# Altium schematic sheet Sheet_1_2025-06-25.schdoc
size 51 x 40 mm
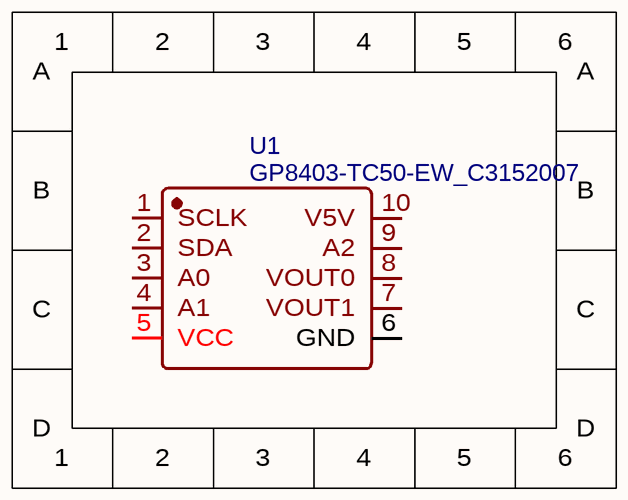
[diagram p0: Sheet_1_2025-06-25.schdoc]

## Parts
U1  GP8403-TC50-EW_C3152007  [ESSOP-10_L4.9-W3.9-P1.00-LS6.0-BL-EP]

## Nets

Not connected (* = marked no-connect by the designer): U1 1(SCLK) 2(SDA) 3(A0) 4(A1) 5(VCC) 6(GND) 7(VOUT1) 8(VOUT0) 9(A2) 10(V5V)

## Library data of the parts
U1 = GP8403-TC50-EW_C3152007: Manufacturer: Guestgood(客益); Contributor: lcsc; Supplier: LCSC; Supplier Part: C3152007; Manufacturer Part: GP8403-TC50-EW; JLCPCB Part Class: Extended Part; spicePre: U; spiceSymbolName: GP8403-TC50-EW_C3152007